# Altium schematic sheet Switching_Regulator.SchDoc
size A
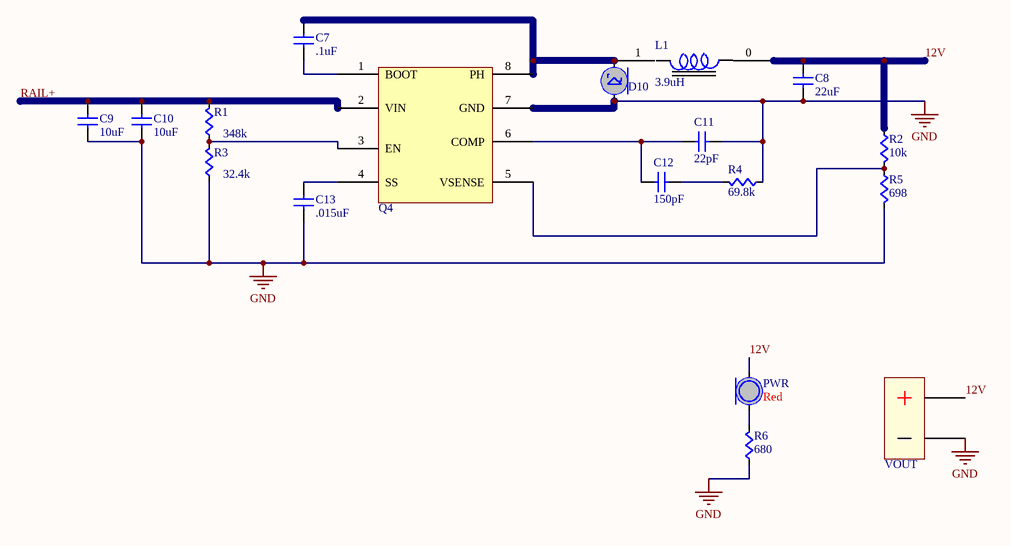
[diagram p0: Switching_Regulator.SchDoc]

## Parts
C7  value .1uF  [CAPC0603]  (hidden comment: Cap)
C8  value 22uF  [CAPC1206]  (hidden comment: Cap)
C9  value 10uF  [CAPC0603]  (hidden comment: Cap)
C10  value 10uF  [CAPC0603]  (hidden comment: Cap)
C11  value 22pF  [CAPC0603]  (hidden comment: Cap)
C12  value 150pF  [CAPC0603]  (hidden comment: Cap)
C13  value .015uF  [CAPC0603]  (hidden comment: Cap)
D10  DFLS160  [RSX501L-20TE25]  (value not drawn)
L1  37392C  [37392C]  (value not drawn)
PWR  Color: Red  [LED0603]  (hidden comment: LED)
Q4  TPS54332DDA  [TPS54332DDA]  (value not drawn)
R1  value 348k  [RES0603]  (hidden comment: Res)
R2  value 10k  [RES0603]  (hidden comment: Res)
R3  value 32.4k  [RES0603]  (hidden comment: Res)
R4  value 69.8k  [RES0603]  (hidden comment: Res)
R5  value 698  [RES0603]  (hidden comment: Res)
R6  value 680  [RES0603]  (hidden comment: Res)
VOUT  BATWIRE  [BATWIRE12]  (value not drawn)

## Nets
GND: C8.2(B) C9.2(B) C10.2(B) C11.2(B) C13.2(B) D10.A Q4.7(GND) R3.2(B) R4.2(B) R5.1(A) R6.2(B) VOUT.-
12V: C8.1(A) L1.0 PWR.A R2.2(B) VOUT.+
RAIL+: C9.1(A) C10.1(A) Q4.2(VIN) R1.1(A)
NetC7_1: C7.1(A) D10.C L1.1 Q4.8(PH)
NetC7_2: C7.2(B) Q4.1(BOOT)
NetC11_1: C11.1(A) C12.1(A) Q4.6(COMP)
NetC12_2: C12.2(B) R4.1(A)
NetC13_1: C13.1(A) Q4.4(SS)
NetPWR_C: PWR.C R6.1(A)
NetQ4_3: Q4.3(EN) R1.2(B) R3.1(A)
NetQ4_5: Q4.5(VSENSE) R2.1(A) R5.2(B)

## Notes on the sheet
- (in symbol 37392C) 3.9uH

## Library data of the parts
D10 = DFLS160: 1.0A Surface Mount Schottky Barrier Rectifier; Supplier 1: Digi-Key; Supplier Part Number 1: RSX501L-20TE25DKR-ND
L1 = 37392C: INDUCTOR 3.90UH 10.0A SMD; Supplier 1: Digi-Key; Supplier Part Number 1: 811-2518-1-ND
Q4 = TPS54332DDA: IC REG BUCK ADJ 3.5A 8SOPWRPAD; Supplier 1: Digi-Key; Supplier Part Number 1: 296-24141-5-ND
VOUT = BATWIRE: Two large gauge leads soldered directly to the board.
C7-C13 = Cap: Supplier 1: Digi-Key
  C7: Supplier Part Number 1: 1276-1000-1-ND
  C8: Supplier Part Number 1: 1276-2725-1-ND
  C9 C10: Supplier Part Number 1: 1276-1869-6-ND
  C11: Supplier Part Number 1: 445-1273-1-ND
  C12: Supplier Part Number 1: 399-1063-1-ND
  C13: Supplier Part Number 1: 1276-1277-6-ND
PWR = LED: Supplier 1: Digi-Key; Supplier Part Number 1: 754-1122-1-ND
R1-R6 = Res: Supplier 1: Digi-Key
  R1: Supplier Part Number 1: RMCF0603FT348KCT-ND
  R2: Supplier Part Number 1: RMCF0603FT10K0CT-ND
  R3: Supplier Part Number 1: P32.4KHCT-ND
  R4: Supplier Part Number 1: RMCF0603FT69K8CT-ND
  R5: Supplier Part Number 1: RMCF0603FT698RDKR-ND
  R6: Supplier Part Number 1: RMCF0603JT10K0CT-ND